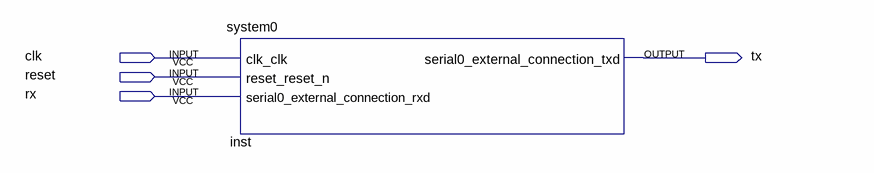
[diagram p0: schematic sheet]
// Quartus schematic Ramps.bdf as structural Verilog: 1 symbols, 4 pins
module Ramps (
  input  clk,
  input  reset,
  input  rx,
  output tx
);

  system0 inst (
    .clk_clk(clk), .reset_reset_n(reset), .serial0_external_connection_rxd(rx),
    .serial0_external_connection_txd(tx));
endmodule
